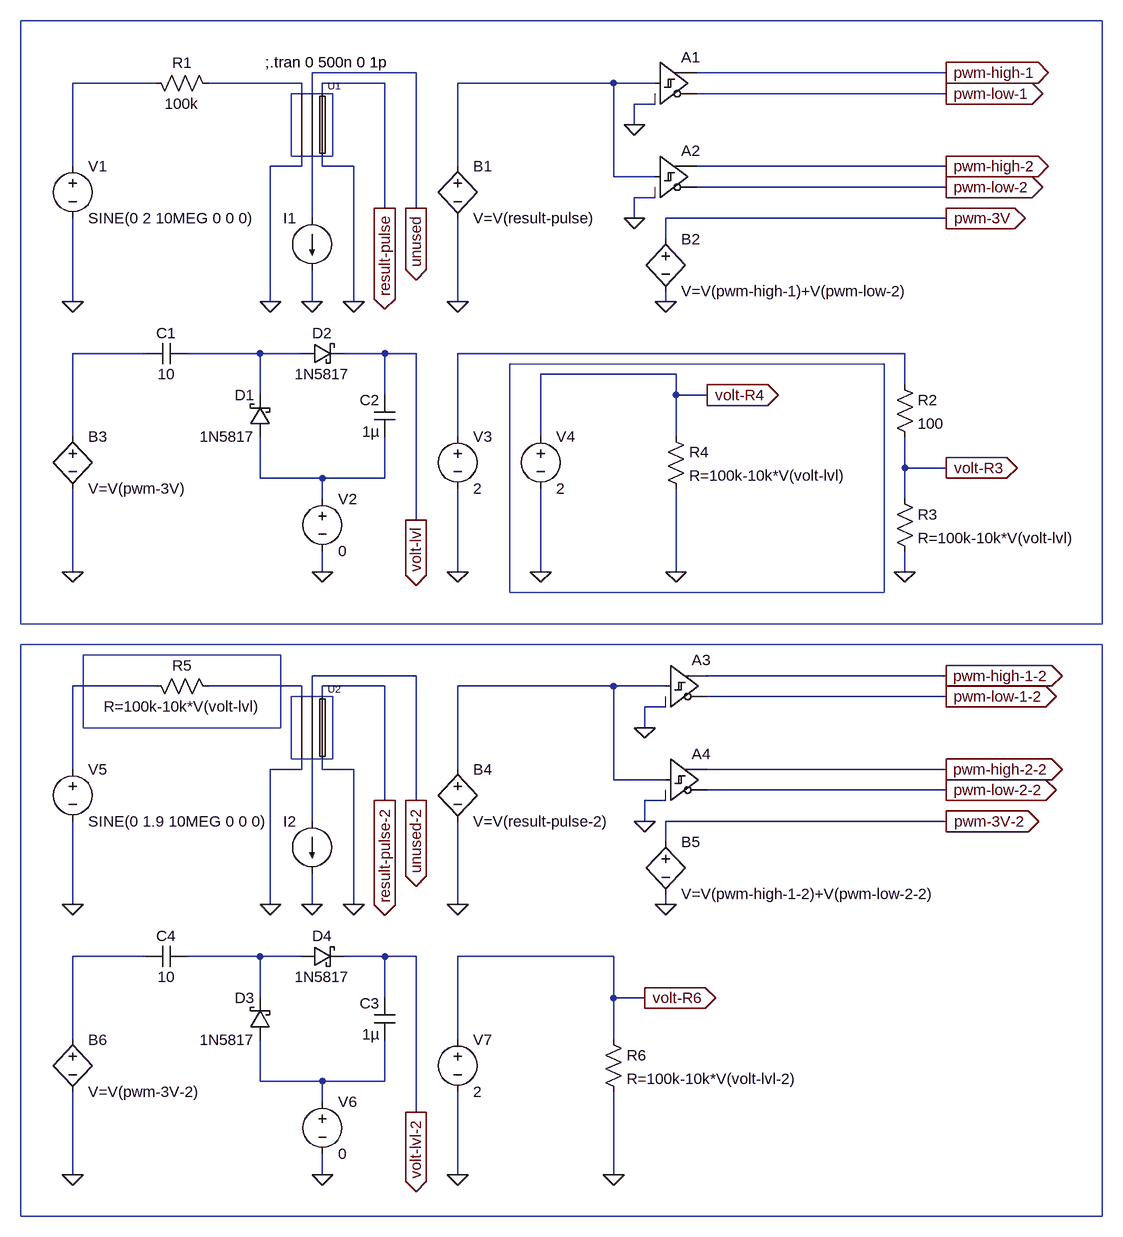
[diagram p0: schematic circuit.asc]
circuit.asc, the LTspice schematic file:
Version 4
SHEET 1 1648 1860
WIRE 256 80 96 80
WIRE 1072 80 688 80
WIRE -144 96 -272 96
WIRE 80 96 -64 96
WIRE 208 96 112 96
WIRE 560 96 320 96
WIRE 624 96 560 96
WIRE 80 112 80 96
WIRE 96 112 96 80
WIRE 112 112 112 96
WIRE 1072 112 688 112
WIRE 624 128 592 128
WIRE 592 160 592 128
WIRE -272 224 -272 96
WIRE 80 224 80 208
WIRE 80 224 32 224
WIRE 112 224 112 208
WIRE 160 224 112 224
WIRE 320 224 320 96
WIRE 1072 224 688 224
WIRE 560 240 560 96
WIRE 624 240 560 240
WIRE 1072 256 688 256
WIRE 624 272 592 272
WIRE 208 288 208 96
WIRE 256 288 256 80
WIRE 96 304 96 208
WIRE 592 304 592 272
WIRE 1072 304 640 304
WIRE 640 336 640 304
WIRE -272 432 -272 304
WIRE 32 432 32 224
WIRE 96 432 96 384
WIRE 160 432 160 224
WIRE 320 432 320 304
WIRE 640 432 640 416
WIRE -160 512 -272 512
WIRE 16 512 -96 512
WIRE 80 512 16 512
WIRE 208 512 144 512
WIRE 256 512 208 512
WIRE 1008 512 320 512
WIRE 656 544 448 544
WIRE 1008 560 1008 512
WIRE 16 576 16 512
WIRE 208 576 208 512
WIRE 656 576 656 544
WIRE 704 576 656 576
WIRE -272 640 -272 512
WIRE 320 640 320 512
WIRE 448 640 448 544
WIRE 656 640 656 576
WIRE 1008 688 1008 640
WIRE 1072 688 1008 688
WIRE 16 704 16 640
WIRE 112 704 16 704
WIRE 208 704 208 640
WIRE 208 704 112 704
WIRE 112 736 112 704
WIRE 1008 736 1008 688
WIRE 256 768 256 512
WIRE -272 848 -272 720
WIRE 112 848 112 816
WIRE 320 848 320 720
WIRE 448 848 448 720
WIRE 656 848 656 720
WIRE 1008 848 1008 816
WIRE 256 1008 96 1008
WIRE 1072 1008 704 1008
WIRE -144 1024 -272 1024
WIRE 80 1024 -64 1024
WIRE 208 1024 112 1024
WIRE 560 1024 320 1024
WIRE 640 1024 560 1024
WIRE 80 1040 80 1024
WIRE 96 1040 96 1008
WIRE 112 1040 112 1024
WIRE 1072 1040 704 1040
WIRE 640 1056 608 1056
WIRE 608 1088 608 1056
WIRE -272 1152 -272 1024
WIRE 80 1152 80 1136
WIRE 80 1152 32 1152
WIRE 112 1152 112 1136
WIRE 160 1152 112 1152
WIRE 320 1152 320 1024
WIRE 1072 1152 704 1152
WIRE 560 1168 560 1024
WIRE 640 1168 560 1168
WIRE 1072 1184 704 1184
WIRE 208 1200 208 1024
WIRE 256 1200 256 1008
WIRE 640 1200 608 1200
WIRE 96 1232 96 1136
WIRE 608 1232 608 1200
WIRE 1072 1232 640 1232
WIRE 640 1264 640 1232
WIRE -272 1360 -272 1232
WIRE 32 1360 32 1152
WIRE 96 1360 96 1312
WIRE 160 1360 160 1152
WIRE 320 1360 320 1232
WIRE 640 1360 640 1344
WIRE -160 1440 -272 1440
WIRE 16 1440 -96 1440
WIRE 80 1440 16 1440
WIRE 208 1440 144 1440
WIRE 256 1440 208 1440
WIRE 560 1440 320 1440
WIRE 16 1504 16 1440
WIRE 208 1504 208 1440
WIRE 560 1504 560 1440
WIRE 608 1504 560 1504
WIRE -272 1568 -272 1440
WIRE 320 1568 320 1440
WIRE 560 1568 560 1504
WIRE 16 1632 16 1568
WIRE 112 1632 16 1632
WIRE 208 1632 208 1568
WIRE 208 1632 112 1632
WIRE 112 1664 112 1632
WIRE 256 1680 256 1440
WIRE -272 1776 -272 1648
WIRE 112 1776 112 1744
WIRE 320 1776 320 1648
WIRE 560 1776 560 1648
FLAG 96 432 0
FLAG 32 432 0
FLAG 160 432 0
FLAG 208 288 result-pulse
IOPIN 208 288 Out
FLAG 256 288 unused
IOPIN 256 288 Out
FLAG -272 432 0
FLAG 320 432 0
FLAG 592 160 0
FLAG 1072 80 pwm-high-1
IOPIN 1072 80 Out
FLAG 1072 112 pwm-low-1
IOPIN 1072 112 Out
FLAG 1072 224 pwm-high-2
IOPIN 1072 224 Out
FLAG 1072 256 pwm-low-2
IOPIN 1072 256 Out
FLAG 640 432 0
FLAG 1072 304 pwm-3V
IOPIN 1072 304 Out
FLAG 112 848 0
FLAG -272 848 0
FLAG 592 304 0
FLAG 256 768 volt-lvl
IOPIN 256 768 Out
FLAG 320 848 0
FLAG 1008 848 0
FLAG 448 848 0
FLAG 656 848 0
FLAG 704 576 volt-R4
IOPIN 704 576 Out
FLAG 1072 688 volt-R3
IOPIN 1072 688 Out
FLAG 96 1360 0
FLAG 32 1360 0
FLAG 160 1360 0
FLAG 208 1200 result-pulse-2
IOPIN 208 1200 Out
FLAG 256 1200 unused-2
IOPIN 256 1200 Out
FLAG -272 1360 0
FLAG 320 1360 0
FLAG 608 1088 0
FLAG 1072 1008 pwm-high-1-2
IOPIN 1072 1008 Out
FLAG 1072 1040 pwm-low-1-2
IOPIN 1072 1040 Out
FLAG 1072 1152 pwm-high-2-2
IOPIN 1072 1152 Out
FLAG 1072 1184 pwm-low-2-2
IOPIN 1072 1184 Out
FLAG 640 1360 0
FLAG 1072 1232 pwm-3V-2
IOPIN 1072 1232 Out
FLAG 608 1232 0
FLAG 112 1776 0
FLAG -272 1776 0
FLAG 256 1680 volt-lvl-2
IOPIN 256 1680 Out
FLAG 320 1776 0
FLAG 560 1776 0
FLAG 608 1504 volt-R6
IOPIN 608 1504 Out
SYMBOL current 96 304 M0
WINDOW 3 24 28 Invisible 2
WINDOW 123 0 0 Left 0
WINDOW 39 24 28 Left 2
SYMATTR Value PWL file=C:\Users\zewen\Downloads\nanowirepp\pwl\gaussian_1.txt
SYMATTR InstName I1
SYMBOL voltage -272 208 R0
SYMATTR InstName V1
SYMATTR Value SINE(0 2 10MEG 0 0 0)
SYMBOL res -160 80 M90
WINDOW 0 0 56 VBottom 2
WINDOW 3 32 56 VTop 2
SYMATTR InstName R1
SYMATTR Value 100k
SYMBOL nanowire 96 160 R0
SYMATTR InstName U1
SYMBOL bv 320 208 R0
SYMATTR InstName B1
SYMATTR Value V=V(result-pulse)
SYMBOL Digital\\schmitt 624 32 R0
WINDOW 3 0 112 Invisible 2
SYMATTR Value vt=1m vh=0 vhigh=3 vlow=0
SYMATTR InstName A1
SYMBOL Digital\\schmitt 624 176 R0
WINDOW 3 0 0 Invisible 0
SYMATTR Value vt=-1m vh=0 vhigh=3 vlow=0
SYMATTR InstName A2
SYMBOL bv 640 320 R0
SYMATTR InstName B2
SYMATTR Value V=V(pwm-high-1)+V(pwm-low-2)
SYMBOL bv -272 624 R0
SYMATTR InstName B3
SYMATTR Value V=V(pwm-3V)
SYMBOL voltage 112 720 R0
SYMATTR InstName V2
SYMATTR Value 0
SYMBOL cap 224 576 M0
SYMATTR InstName C2
SYMATTR Value 1µ
SYMBOL cap -96 496 R90
WINDOW 0 0 32 VBottom 2
WINDOW 3 32 32 VTop 2
SYMATTR InstName C1
SYMATTR Value 10
SYMBOL schottky 32 640 R180
WINDOW 0 24 64 Left 2
WINDOW 3 24 0 Left 2
SYMATTR InstName D1
SYMATTR Value 1N5817
SYMATTR Description Diode
SYMATTR Type diode
SYMBOL schottky 80 528 R270
WINDOW 0 32 32 VTop 2
WINDOW 3 0 32 VBottom 2
SYMATTR InstName D2
SYMATTR Value 1N5817
SYMATTR Description Diode
SYMATTR Type diode
SYMBOL voltage 320 624 R0
WINDOW 123 0 0 Left 0
WINDOW 39 0 0 Left 0
SYMATTR InstName V3
SYMATTR Value 2
SYMBOL res 992 720 R0
SYMATTR InstName R3
SYMATTR Value R=100k-10k*V(volt-lvl)
SYMBOL res 992 544 R0
SYMATTR InstName R2
SYMATTR Value 100
SYMBOL voltage 448 624 R0
SYMATTR InstName V4
SYMATTR Value 2
SYMBOL res 640 624 R0
SYMATTR InstName R4
SYMATTR Value R=100k-10k*V(volt-lvl)
SYMBOL current 96 1232 M0
WINDOW 3 24 28 Invisible 2
WINDOW 123 0 0 Left 0
WINDOW 39 24 28 Left 2
SYMATTR Value PWL file=C:\Users\zewen\Downloads\nanowirepp\pwl\gaussian_2.txt
SYMATTR InstName I2
SYMBOL voltage -272 1136 R0
SYMATTR InstName V5
SYMATTR Value SINE(0 1.9 10MEG 0 0 0)
SYMBOL res -160 1008 M90
WINDOW 0 0 56 VBottom 2
WINDOW 3 32 56 VTop 2
SYMATTR InstName R5
SYMATTR Value R=100k-10k*V(volt-lvl)
SYMBOL nanowire 96 1088 R0
SYMATTR InstName U2
SYMBOL bv 320 1136 R0
SYMATTR InstName B4
SYMATTR Value V=V(result-pulse-2)
SYMBOL Digital\\schmitt 640 960 R0
WINDOW 3 0 112 Invisible 2
SYMATTR Value vt=1m vh=0 vhigh=3 vlow=0
SYMATTR InstName A3
SYMBOL Digital\\schmitt 640 1104 R0
WINDOW 3 0 0 Invisible 0
SYMATTR Value vt=-1m vh=0 vhigh=3 vlow=0
SYMATTR InstName A4
SYMBOL bv 640 1248 R0
SYMATTR InstName B5
SYMATTR Value V=V(pwm-high-1-2)+V(pwm-low-2-2)
SYMBOL bv -272 1552 R0
SYMATTR InstName B6
SYMATTR Value V=V(pwm-3V-2)
SYMBOL voltage 112 1648 R0
SYMATTR InstName V6
SYMATTR Value 0
SYMBOL cap 224 1504 M0
SYMATTR InstName C3
SYMATTR Value 1µ
SYMBOL cap -96 1424 R90
WINDOW 0 0 32 VBottom 2
WINDOW 3 32 32 VTop 2
SYMATTR InstName C4
SYMATTR Value 10
SYMBOL schottky 32 1568 R180
WINDOW 0 24 64 Left 2
WINDOW 3 24 0 Left 2
SYMATTR InstName D3
SYMATTR Value 1N5817
SYMATTR Description Diode
SYMATTR Type diode
SYMBOL schottky 80 1456 R270
WINDOW 0 32 32 VTop 2
WINDOW 3 0 32 VBottom 2
SYMATTR InstName D4
SYMATTR Value 1N5817
SYMATTR Description Diode
SYMATTR Type diode
SYMBOL voltage 320 1552 R0
SYMATTR InstName V7
SYMATTR Value 2
SYMBOL res 544 1552 R0
SYMATTR InstName R6
SYMATTR Value R=100k-10k*V(volt-lvl-2)
TEXT 24 64 Left 2 !;.tran 0 500n 0 1p
RECTANGLE Normal 128 208 64 112
RECTANGLE Normal 976 880 400 528
RECTANGLE Normal 1312 928 -352 0
RECTANGLE Normal 128 1136 64 1040
RECTANGLE Normal -352 960 -352 960 2
RECTANGLE Normal 1312 1840 -352 960
RECTANGLE Normal 48 1088 -256 976

The netlist it stands for:
* circuit.asc
I1 N004 0 PWL file=C:\Users\zewen\Downloads\nanowirepp\pwl\gaussian_1.txt
V1 N001 0 SINE(0 2 10MEG 0 0 0)
R1 N001 N002 100k
XU1 N002 0 unused N004 result-pulse 0 nanowire  ; pins g1 g2 n1 n2 n3 n4
B1 N003 0 V=V(result-pulse)
A1 N003 0 0 0 0 pwm-low-1 pwm-high-1 0 SCHMITT vt=1m vh=0 vhigh=3 vlow=0
A2 N003 0 0 0 0 pwm-low-2 pwm-high-2 0 SCHMITT vt=-1m vh=0 vhigh=3 vlow=0
B2 pwm-3V 0 V=V(pwm-high-1)+V(pwm-low-2)
B3 N005 0 V=V(pwm-3V)
V2 N008 0 0
C2 volt-lvl N008 1µ
C1 N006 N005 10
D1 N008 N006 1N5817
D2 N006 volt-lvl 1N5817
V3 N007 0 2
R3 volt-R3 0 R=100k-10k*V(volt-lvl)
R2 N007 volt-R3 100
V4 volt-R4 0 2
R4 volt-R4 0 R=100k-10k*V(volt-lvl)
I2 N012 0 PWL file=C:\Users\zewen\Downloads\nanowirepp\pwl\gaussian_2.txt
V5 N009 0 SINE(0 1.9 10MEG 0 0 0)
R5 N009 N010 R=100k-10k*V(volt-lvl)
XU2 N010 0 unused-2 N012 result-pulse-2 0 nanowire  ; pins g1 g2 n1 n2 n3 n4
B4 N011 0 V=V(result-pulse-2)
A3 N011 0 0 0 0 pwm-low-1-2 pwm-high-1-2 0 SCHMITT vt=1m vh=0 vhigh=3 vlow=0
A4 N011 0 0 0 0 pwm-low-2-2 pwm-high-2-2 0 SCHMITT vt=-1m vh=0 vhigh=3 vlow=0
B5 pwm-3V-2 0 V=V(pwm-high-1-2)+V(pwm-low-2-2)
B6 N013 0 V=V(pwm-3V-2)
V6 N015 0 0
C3 volt-lvl-2 N015 1µ
C4 N014 N013 10
D3 N015 N014 1N5817
D4 N014 volt-lvl-2 1N5817
V7 volt-R6 0 2
R6 volt-R6 0 R=100k-10k*V(volt-lvl-2)
.model D D
.lib standard.dio
;.tran 0 500n 0 1p
.lib nanowire.lib
.backanno
.end